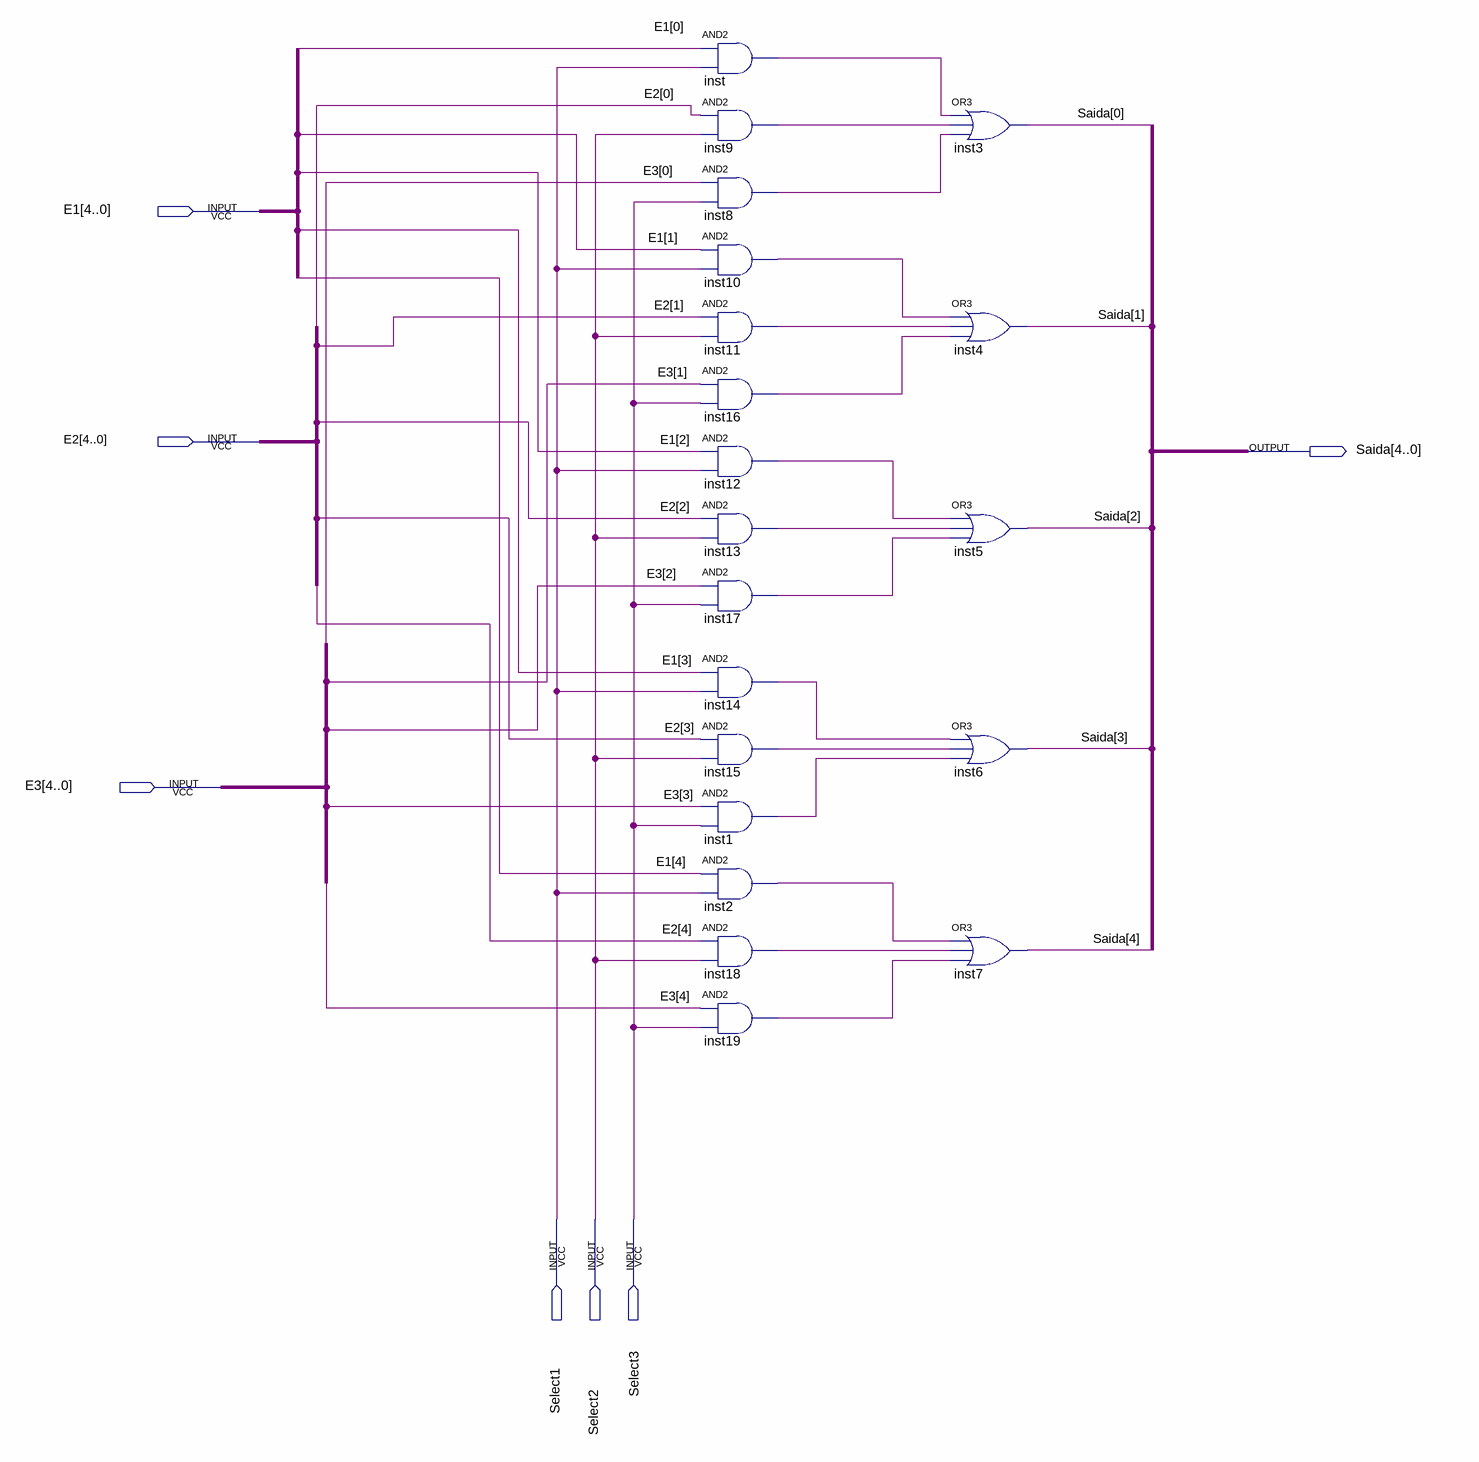
[diagram p0: schematic sheet]
// Quartus schematic MUX_3S_3E_5bits.bdf as structural Verilog: 20 symbols, 7 pins
module MUX_3S_3E_5bits (
  input  [4:0] E1,
  input  [4:0] E2,
  input  [4:0] E3,
  input  Select1,
  input  Select2,
  input  Select3,
  output [4:0] Saida
);

  wire inst1_out, inst2_out, inst8_out, inst9_out, inst10_out, inst11_out, inst12_out, inst13_out,
       inst14_out, inst15_out, inst16_out, inst17_out, inst18_out, inst19_out, inst_out;

  and inst (inst_out, E1[0], Select1);
  and inst9 (inst9_out, E2[0], Select2);
  and inst8 (inst8_out, E3[0], Select3);
  and inst10 (inst10_out, E1[1], Select1);
  and inst11 (inst11_out, E2[1], Select2);
  and inst16 (inst16_out, E3[1], Select3);
  and inst12 (inst12_out, E1[2], Select1);
  and inst13 (inst13_out, E2[2], Select2);
  and inst17 (inst17_out, E3[2], Select3);
  and inst14 (inst14_out, E1[3], Select1);
  and inst15 (inst15_out, E2[3], Select2);
  and inst1 (inst1_out, E3[3], Select3);
  and inst2 (inst2_out, E1[4], Select1);
  and inst18 (inst18_out, E2[4], Select2);
  and inst19 (inst19_out, E3[4], Select3);
  or inst3 (Saida[0], inst_out, inst9_out, inst8_out);
  or inst4 (Saida[1], inst10_out, inst11_out, inst16_out);
  or inst5 (Saida[2], inst12_out, inst13_out, inst17_out);
  or inst6 (Saida[3], inst14_out, inst15_out, inst1_out);
  or inst7 (Saida[4], inst2_out, inst18_out, inst19_out);
endmodule
